# EAGLE design untitled2 (EAGLE 7.5.0)
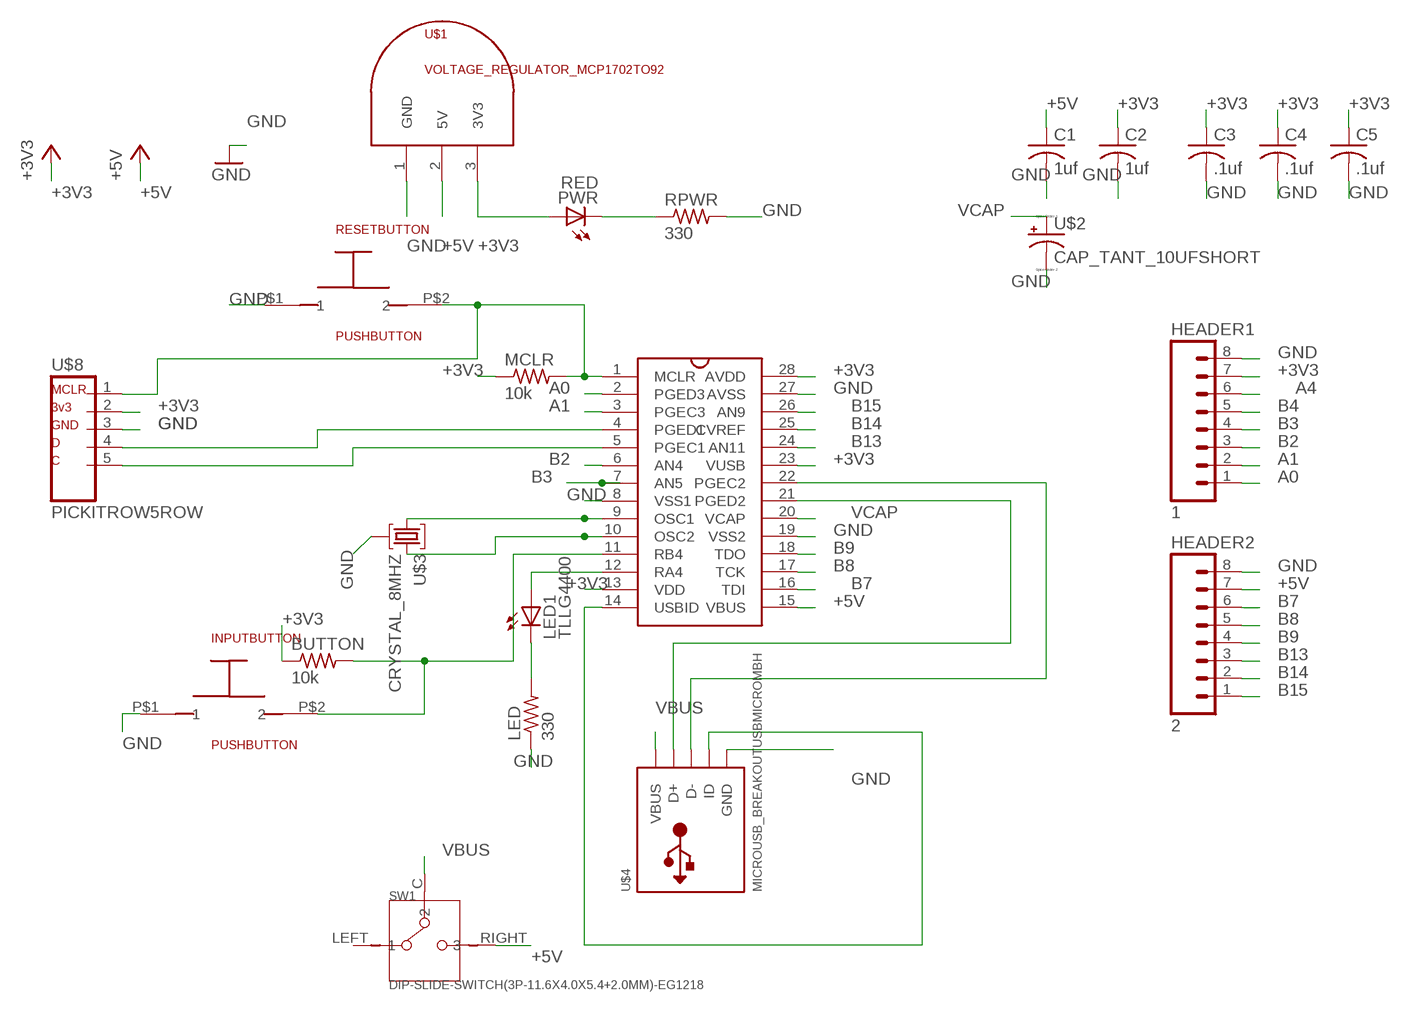
[diagram p0: schematic, sheet 1]

## Parts
BUTTON  10k  R-US_0207/10  [0207/10]
C1  1uf  C-US025-030X050  [C025-030X050]
C2  1uf  C-US025-030X050  [C025-030X050]
C3  .1uf  C-US025-030X050  [C025-030X050]
C4  .1uf  C-US025-030X050  [C025-030X050]
C5  .1uf  C-US025-030X050  [C025-030X050]
HEADER1  1  M08  [1X08_ROUND]
HEADER2  2  M08  [1X08_ROUND]
INPUTBUTTON  PUSHBUTTON  [PUSHBUTTON]
LED  330  R-US_0207/10  [0207/10]
LED1  TLLG4400  [LED3MM]
MCLR  10k  R-US_0207/10  [0207/10]
PWR  RED  LED3MM  [LED3MM]
RESETBUTTON  PUSHBUTTON  [PUSHBUTTON]
RPWR  330  R-US_0207/10  [0207/10]
SW1  DIP-SLIDE-SWITCH(3P-11.6X4.0X5.4+2.0MM)-EG1218  [SW3-2.5-11.6X4.0X5.4+2.0MM]
U$1  VOLTAGE_REGULATOR_MCP1702TO92  [TO92]
U$2  CAP_TANT_10UFSHORT  [C025-040X050POL]
U$3  CRYSTAL_8MHZ  [CRYSTAL_8MHZ]
U$4  MICROUSB_BREAKOUTUSBMICROMBH  [USB-MB-H]
U$5  PIC32MX250F128B  [DIL28-3]
U$8  PICKITROW5ROW  [1X05]

## Nets
+3V3: BUTTON.1 C2.1 C3.1 C4.1 C5.1 HEADER1.7 MCLR.1 PWR.A U$1.3(3V3) U$5.13(VDD) U$5.23(VUSB) U$5.28(AVDD) U$8.2(3V3)
+5V: C1.1 HEADER2.7 SW1.RIGHT U$1.2(5V) U$5.15(VBUS)
A0: HEADER1.1 U$5.2(PGED3)
A1: HEADER1.2 U$5.3(PGEC3)
A4: HEADER1.6 LED1.A U$5.12(RA4)
B2: HEADER1.3 U$5.6(AN4)
B3: HEADER1.4 U$5.7(AN5)
B4: BUTTON.2 HEADER1.5 INPUTBUTTON.P$2 U$5.11(RB4)
B7: HEADER2.6 U$5.16(TDI)
B8: HEADER2.5 U$5.17(TCK)
B9: HEADER2.4 U$5.18(TDO)
B13: HEADER2.3 U$5.24(AN11)
B14: HEADER2.2 U$5.25(CVREF)
B15: HEADER2.1 U$5.26(AN9)
GND: C1.2 C2.2 C3.2 C4.2 C5.2 HEADER1.8 HEADER2.8 INPUTBUTTON.P$1 LED.1 RESETBUTTON.P$1 RPWR.2 U$1.1(GND) U$2.- U$3.GND U$4.GND U$5.8(VSS1) U$5.19(VSS2) U$5.27(AVSS) U$8.3(GND)
MCLR: MCLR.2 RESETBUTTON.P$2 U$5.1(MCLR) U$8.1(MCLR)
N$1: LED1.K(C) LED.2
N$2: PWR.K(C) RPWR.1
OSC1: U$3.OSC1 U$5.9(OSC1)
OSC2: U$3.OSC2 U$5.10(OSC2)
PICKITC: U$5.5(PGEC1) U$8.5(C)
PICKITD: U$5.4(PGED1) U$8.4(D)
USBD+: U$4.D+ U$5.21(PGED2)
USBD-: U$4.D- U$5.22(PGEC2)
USBID: U$4.ID U$5.14(USBID)
VBUS: SW1.C U$4.VBUS
VCAP: U$2.+ U$5.20(VCAP)
Unconnected: SW1.LEFT

## Library data of the parts
BUTTON LED MCLR RPWR = components:R-US_: RESISTOR, American symbol
C1-C5 = components:C-US: CAPACITOR, American symbol
HEADER1 HEADER2 = components:M08: Header 8 Standard 8-pin 0.1" header. Use with straight break away headers (SKU : PRT-00116), right angle break away headers (PRT-00553), swiss pins (PRT-00743), machine pins (PRT-00117), and female headers (PRT-00115).; PROD_ID: CONN-08437
INPUTBUTTON RESETBUTTON = components:PUSHBUTTON
LED1 = components:TLLG4400: Low Current (2mA) LED 3 mm Tinted Diffused Package color GREEN Source: Data sheet <http://www.farnell.com/datasheets/391098.pdf>; MF: VISHAY SEMICONDUCTOR; OC_FARNELL: 1612435
PWR = components:LED: LED OSRAM: - CHIPLED LG R971, LG N971, LY N971, LG Q971, LY Q971, LO R971, LY R971 LH N974, LH R974 LS Q976, LO Q976, LY Q976 LO Q996 - Hyper CHIPLED LW Q18S LB Q993, LB Q99A, LB R99A - SideLED LS A670, LO A670, LY A670, LG A670, LP A670 LB A673, LV A673, LT A673, LW A673 LH A674 LY A675 LS A676, LA A676, LO A676, LY A676, LW A676 LS A679, LY A679, LG A679 - Hyper Micro SIDELED® LS Y876, LA Y876, LO Y876, LY Y876 LT Y87S - SmartLED LW L88C, LW L88S LB L89C, LB L89S, LG L890 LS L89K, LO L89K, LY L89K LS L896, LA L896, LO L896, LY L896 - TOPLED LS T670, LO T670, LY T670, LG T670, LP T670 LSG T670, LSP T670, LSY T670, LOP T670, LYG T670 LG T671, LOG T671, LSG T671 LB T673, LV T673, LT T673, LW T673 LH T674 LS T676, LA T676, LO T676, LY T676, LB T676, LH T676, LSB T676, LW T676 LB T67C, LV T67C, LT T67C, LS T67K, LO T67K, LY T67K, LW E67C LS E67B, LA E67B, LO E67B, LY E67B, LB E67C, LV E67C, LT E67C LW T67C LS T679, LY T679, LG T679 LS T770, LO T770, LY T770, LG T770, LP T770 LB T773, LV T773, LT T773, LW T773 LH T774 LS E675, LA E675, LY E675, LS T675 LS T776, LA T776, LO T776, LY T776, LB T776 LHGB T686 LT T68C, LB T68C - Hyper Mini TOPLED® LB M676 - Mini TOPLED Santana® LG M470 LS M47K, LO M47K, LY M47K Source: http://www.osram.convergy.de LUXEON: - LUMILED® LXK2-PW12-R00, LXK2-PW12-S00, LXK2-PW14-U00, LXK2-PW14-V00 LXK2-PM12-R00, LXK2-PM12-S00, LXK2-PM14-U00 LXK2-PE12-Q00, LXK2-PE12-R00, LXK2-PE12-S00, LXK2-PE14-T00, LXK2-PE14-U00 LXK2-PB12-K00, LXK2-PB12-L00, LXK2-PB12-M00, LXK2-PB14-N00, LXK2-PB14-P00, LXK2-PB14-Q00 LXK2-PR12-L00, LXK2-PR12-M00, LXK2-PR14-Q00, LXK2-PR14-R00 LXK2-PD12-Q00, LXK2-PD12-R00, LXK2-PD12-S00 LXK2-PH12-R00, LXK2-PH12-S00 LXK2-PL12-P00, LXK2-PL12-Q00, LXK2-PL12-R00 Source: www.luxeon.com KINGBRIGHT: KA-3528ASYC Source: www.kingbright.com
SW1 = components:DIP-SLIDE-SWITCH(3P-11.6X4.0X5.4+2.0MM): 311010006
U$1 = components:VOLTAGE_REGULATOR_MCP1702
U$2 = components:CAP_TANT_10UF
U$3 = components:CRYSTAL_8MHZ
U$4 = components:MICROUSB_BREAKOUT
U$5 = components:PIC32MX250F128B
U$8 = components:PICKITROW

## Board
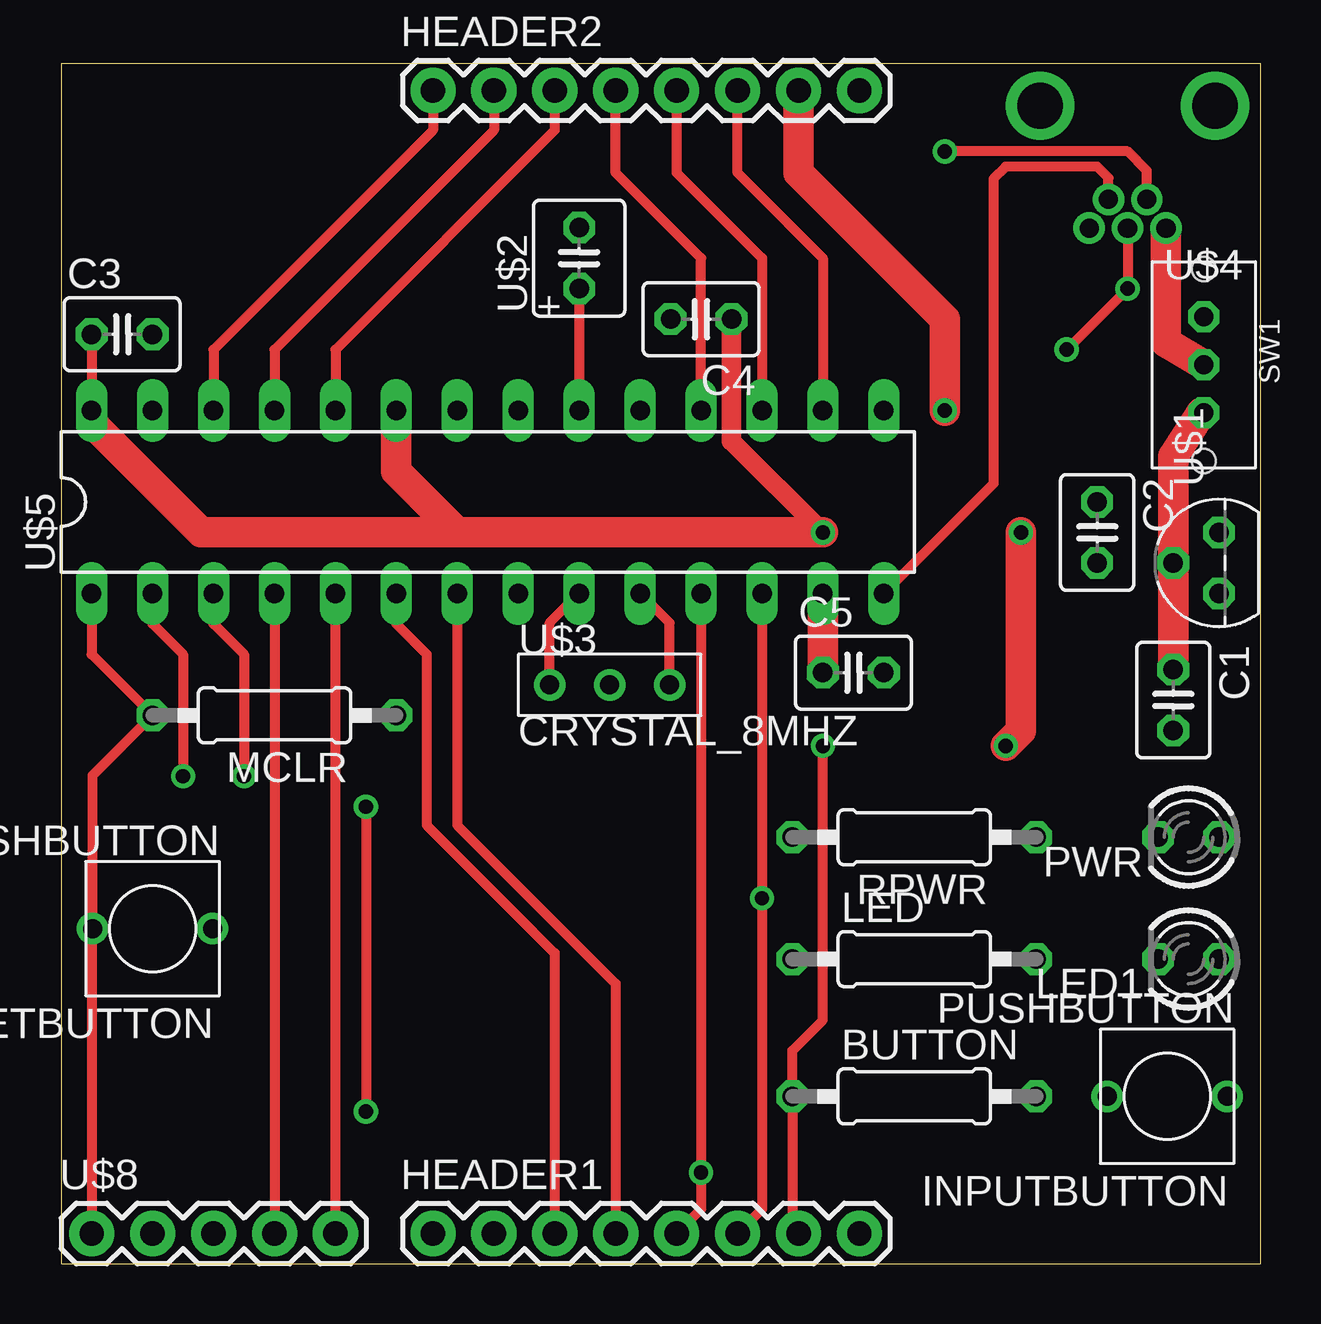
[diagram p1: board, top side]
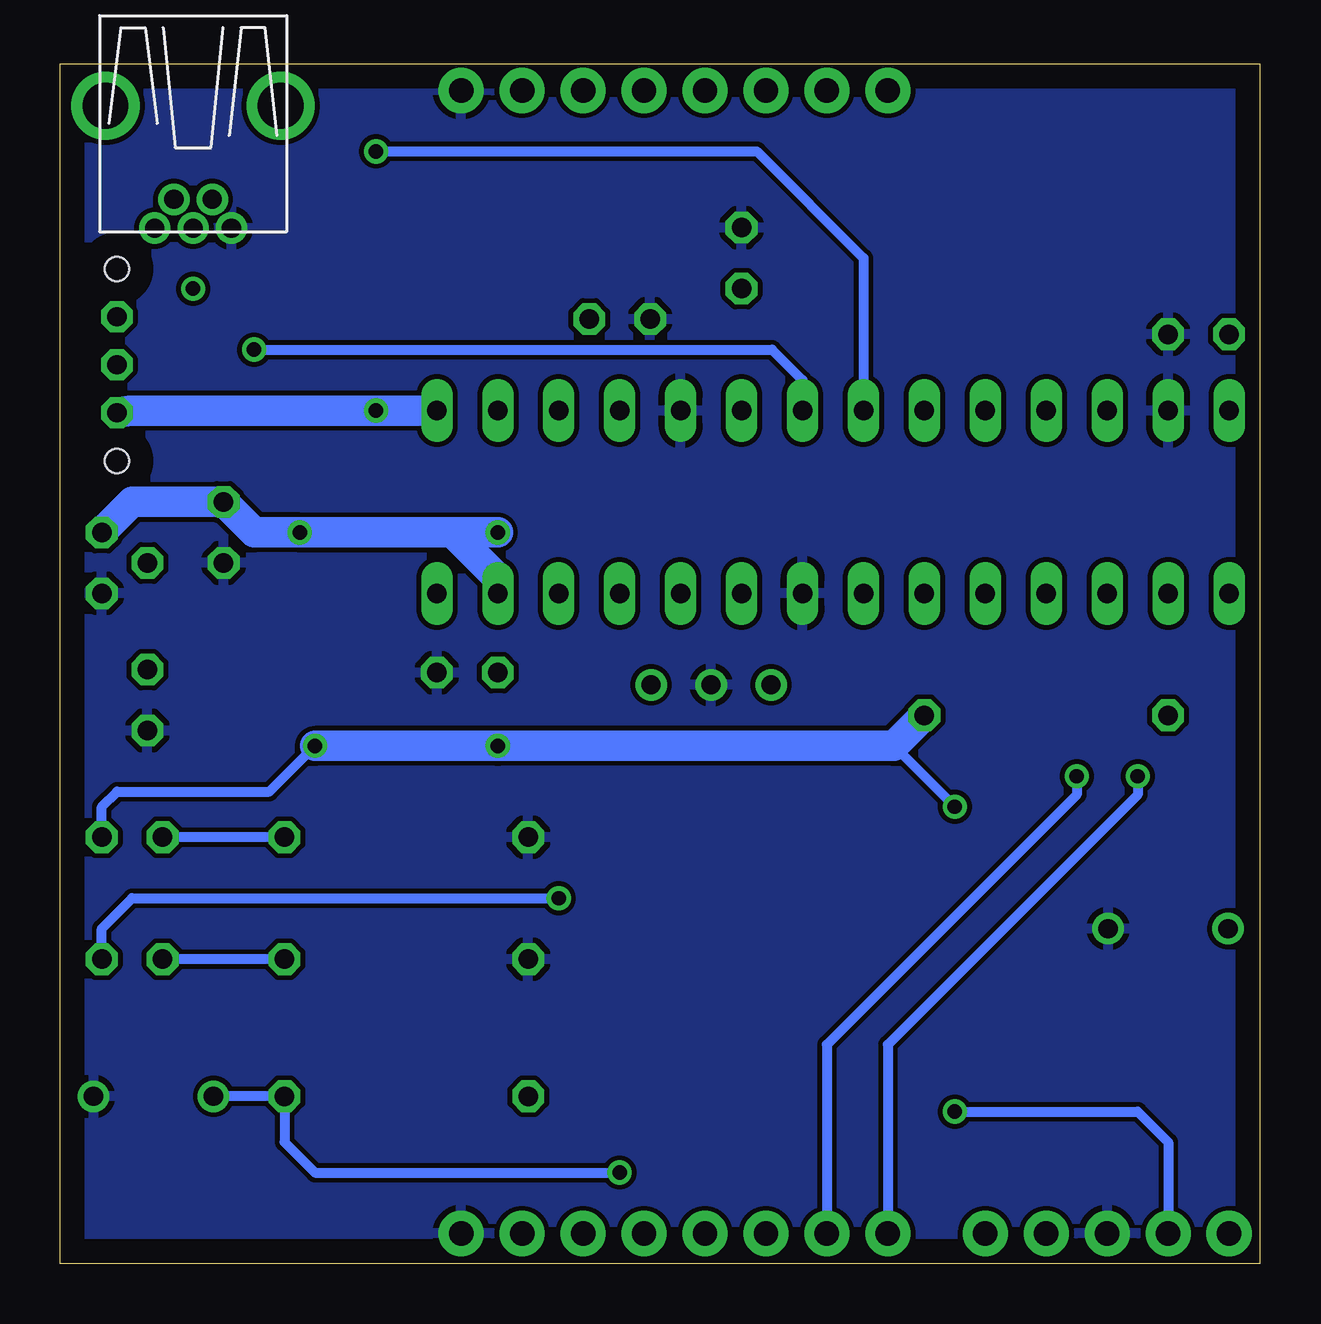
[diagram p2: board, bottom side, seen from below]

Size 50 x 50 mm. Coordinates in mm from the lower left corner, seen from the top.
Outline: 0,0 50,0 50,50 0,50 0,0
Copper layers (1*16): Top 0.035mm / dielectric 1.5mm / Bottom 0.035mm
Design rules "default": minimum track width 10mil, minimum drill 24mil, track to track 8mil, track to pad 8mil, pad to pad 8mil, via to via 8mil, smd to smd 8mil, copper to edge 40mil, drill to drill 8mil, minimum pad ring 10mil, minimum via ring 8mil, stop-mask expansion 4mil, vias tented up to drill 0mil, thermal gap 10mil

### Footprints (pad centres in the part's own frame; a part is rotated, then mirrored left to right if it is on the bottom)
0207/10 = drill 0.813 octagon: 1 -5.08,0; 2 5.08,0
C025-030X050 = drill 0.813 octagon: 1 -1.27,0; 2 1.27,0
1X08_ROUND = drill 1.016 pad 1.88: 1 0,0; 2 2.54,0; 3 5.08,0; 4 7.62,0; 5 10.16,0; 6 12.7,0; 7 15.24,0; 8 17.78,0
PUSHBUTTON = drill 0.8: P$1 -2.5,0; P$2 2.5,0
LED3MM = drill 0.813 octagon: A -1.27,0; K 1.27,0
SW3-2.5-11.6X4.0X5.4+2.0MM = drill 0.8 octagon: C 0,0; LEFT -2,0; RIGHT 2,0 | hole 1: -4,0; 4,0
TO92 = drill 0.813 octagon: 1 -1.27,0; 2 0,1.905; 3 1.27,0
C025-040X050POL = drill 0.813 octagon: + -1.27,0; - 1.27,0
CRYSTAL_8MHZ = drill 0.8: GND 0,0; OSC1 -2.5,0; OSC2 2.5,0
USB-MB-H = drill 0.8: D+ 5.1,0; D- 3.9,0.8; GND 5.1,-1.6; ID 3.9,-0.8; VBUS 5.1,1.6 | drill 1.9: P$6 0,-3.65; P$7 0,3.65
DIL28-3 = drill 0.813 long: 1 -16.51,-3.81; 2 -13.97,-3.81; 3 -11.43,-3.81; 4 -8.89,-3.81; 5 -6.35,-3.81; 6 -3.81,-3.81; 7 -1.27,-3.81; 8 1.27,-3.81; 9 3.81,-3.81; 10 6.35,-3.81; 11 8.89,-3.81; 12 11.43,-3.81; 13 13.97,-3.81; 14 16.51,-3.81; 15 16.51,3.81; 16 13.97,3.81; 17 11.43,3.81; 18 8.89,3.81; 19 6.35,3.81; 20 3.81,3.81; 21 1.27,3.81; 22 -1.27,3.81; 23 -3.81,3.81; 24 -6.35,3.81; 25 -8.89,3.81; 26 -11.43,3.81; 27 -13.97,3.81; 28 -16.51,3.81
1X05 = drill 1.016 pad 1.88: 1 0,0; 2 2.54,0; 3 5.08,0; 4 7.62,0; 5 10.16,0

### Placement (x,y rotation side)
BUTTON  35.56,6.99 0 top
C1  46.35,23.5 270 top
C2  43.18,30.48 270 top
C3  2.54,38.73 0 top
C4  26.67,39.37 180 top
C5  33.02,24.64 0 top
HEADER1  15.49,1.27 0 top
HEADER2  15.49,48.9 0 top
INPUTBUTTON  46.1,6.99 180 top
LED  35.56,12.7 0 top
LED1  46.99,12.7 180 top
MCLR  8.89,22.86 180 top
PWR  46.99,17.78 180 top
RESETBUTTON  3.81,13.97 180 top
RPWR  35.56,17.78 180 top
SW1  47.62,37.47 270 top
U$1  48.26,29.21 90 top
U$2  21.59,41.91 90 top
U$3  22.86,24.13 0 top
U$4  44.45,48.26 270 top
U$5  17.78,31.75 0 top
U$8  1.27,1.27 0 top

### Tracks (layer width: path | path; a pad name or v marks a point on that pad's centre or on a via)
+3V3  (via drill 0.6)
  Top 0.406: C3.1 U$5.28 | v31.75,21.59 31.75,10.16 30.48,8.89 BUTTON.1 30.48,1.52 HEADER1.7 | v12.7,19.05 v12.7,6.35
  Top 0.813: C4.1 27.94,34.29 v31.75,30.48
  Top 1.27: v40.01,30.48 40.01,22.23 v39.37,21.59 | v31.75,30.48 16.51,30.48 | 16.51,30.48 13.97,33.02 U$5.23 | 16.51,30.48 5.84,30.48 1.27,35.05 U$5.28 | C5.1 U$5.13
  Bottom 0.406: PWR.A 48.26,19.05 47.62,19.68 41.27,19.68 v39.37,21.59 | 15.24,21.59 v12.7,19.05 | v12.7,6.35 5.08,6.35 3.81,5.08 U$8.2
  Bottom 1.27: 33.66,30.48 v40.01,30.48 41.91,30.48 C2.1 46.99,31.75 U$1.3 | 33.66,30.48 v31.75,30.48 | U$5.13 31.75,28.57 33.66,30.48 | v39.37,21.59 v31.75,21.59 15.24,21.59 MCLR.1
+5V  (via drill 0.6)
  Top 1.27: SW1.RIGHT 47.53,35.47 46.35,33.66 U$1.2 C1.1 | v36.83,35.56 36.83,39.37 30.73,45.47 HEADER2.7
  Bottom 1.27: U$5.15 v36.83,35.56 47.09,35.56 SW1.RIGHT
A0  (via drill 0.6)
  Top 0.406: U$5.2 3.81,26.67 5.08,25.4 v5.08,20.32
  Bottom 0.406: v5.08,20.32 5.08,19.56 15.49,9.14 HEADER1.1
A1  (via drill 0.6)
  Top 0.406: U$5.3 6.35,26.67 7.62,25.4 v7.62,20.32
  Bottom 0.406: v7.62,20.32 7.62,19.56 18.03,9.14 HEADER1.2
A4  (via drill 0.6)
  Top 0.406: U$5.12 v29.21,15.24 29.21,2.29 HEADER1.6
  Bottom 0.406: LED1.A 48.26,13.97 46.99,15.24 v29.21,15.24
B2
  Top 0.406: U$5.6 13.97,26.67 15.24,25.4 15.24,18.29 20.57,12.95 HEADER1.3
B3
  Top 0.406: U$5.7 16.51,18.29 23.11,11.68 HEADER1.4
B4  (via drill 0.6)
  Top 0.406: U$5.11 v26.67,3.81 26.67,2.29 HEADER1.5
  Bottom 0.406: INPUTBUTTON.P$2 BUTTON.2 40.64,5.08 39.37,3.81 v26.67,3.81
B7
  Top 0.406: U$5.16 31.75,41.91 28.19,45.47 HEADER2.6
B8
  Top 0.406: U$5.17 29.21,41.91 25.65,45.47 HEADER2.5
B9
  Top 0.406: U$5.18 26.67,41.91 23.11,45.47 HEADER2.4
B13
  Top 0.406: HEADER2.3 20.57,47.24 11.43,38.1 U$5.24
B14
  Top 0.406: HEADER2.2 18.03,47.24 8.89,38.1 U$5.25
B15
  Top 0.406: HEADER2.1 15.49,47.24 6.35,38.1 U$5.26
GND
  pour Bottom: 0,0 50,0 50,50 0,50
MCLR
  Top 0.406: U$8.1 1.27,13.97 RESETBUTTON.P$2 1.31,20.36 MCLR.2 1.27,25.4 U$5.1
N$1
  Bottom 0.406: LED.2 LED1.K
N$2
  Bottom 0.406: RPWR.1 PWR.K
OSC1
  Top 0.406: U$3.OSC1 20.36,26.71 U$5.9
OSC2
  Top 0.406: U$3.OSC2 25.36,26.71 U$5.10
PICKITC
  Top 0.406: U$8.5 U$5.5
PICKITD
  Top 0.406: U$5.4 U$8.4
USBD+  (via drill 0.6)
  Top 0.406: 44.45,43.18 U$4.D+ v44.45,40.64 v41.91,38.1
  Bottom 0.406: v41.91,38.1 20.32,38.1 19.05,36.83 U$5.21
USBD-  (via drill 0.6)
  Top 0.406: U$4.D- 45.25,45.55 44.45,46.35 v36.83,46.35
  Bottom 0.406: U$5.22 16.51,41.91 20.95,46.35 v36.83,46.35
USBID
  Top 0.406: U$4.ID 43.65,45.25 43.18,45.72 39.37,45.72 38.86,45.21 38.86,32.51 U$5.14
VBUS
  Top 1.27: U$4.VBUS 46.05,38.41 SW1.C
VCAP
  Top 0.406: U$2.+ U$5.20